# EAGLE schematic MiniMoto -- BREAKOUT (EAGLE 6.4)
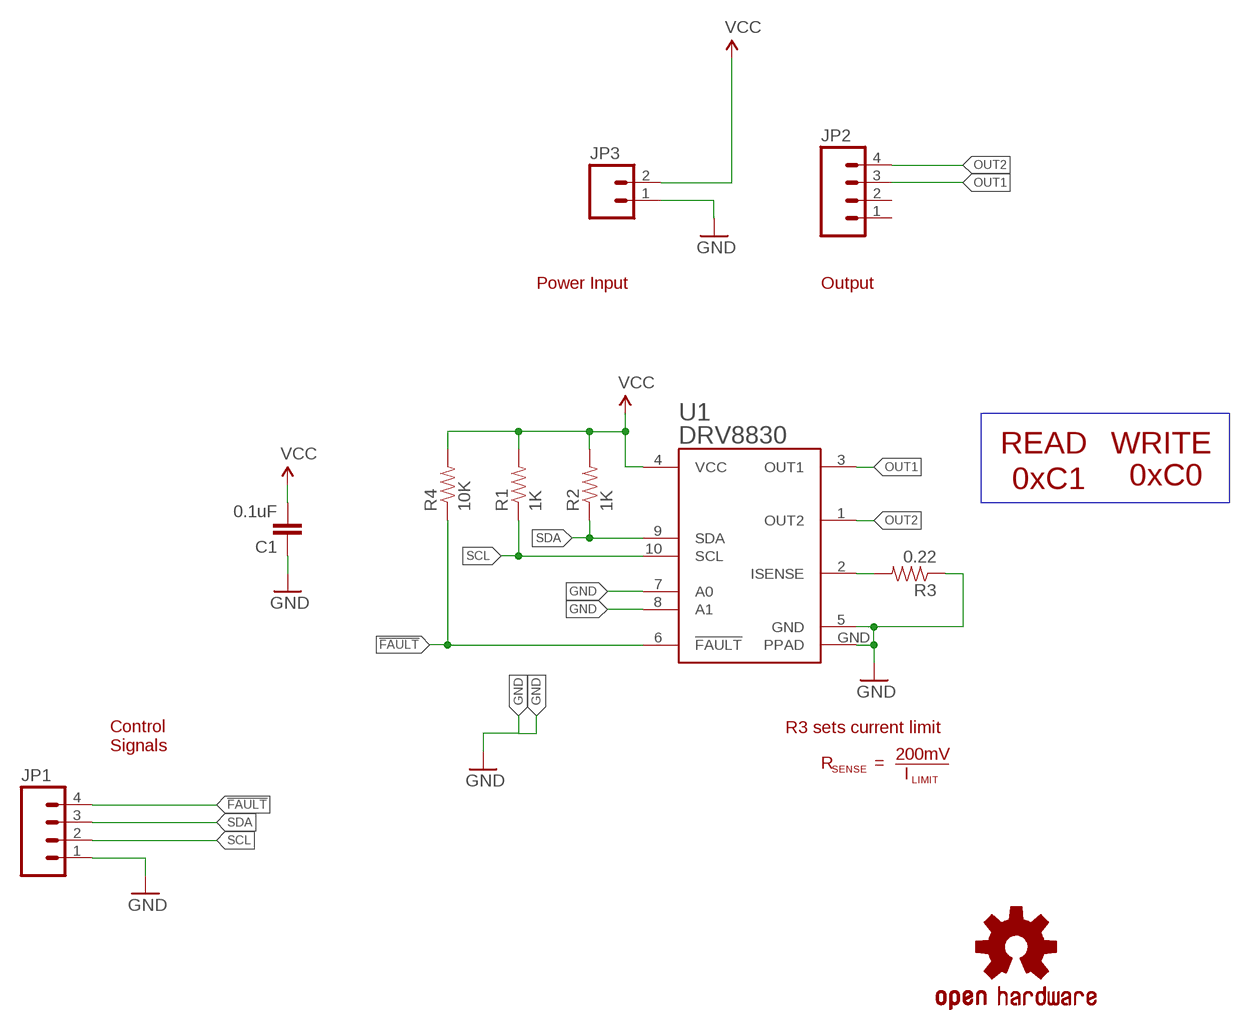
[diagram p0: schematic, sheet 1]

## Parts
C1  0.1uF  0.1UF-25V(+80/-20%)(0603)  [0603-CAP]
JP1  M04PTH  [1X04]
JP2  M04PTH  [1X04]
JP3  M02LOCK  [1X02_LOCK]
LOGO3  OSHW-LOGOS  [OSHW-LOGO-S]
R1  1K  1KOHM1/10W1%(0603)  [0603-RES]
R2  1K  1KOHM1/10W1%(0603)  [0603-RES]
R3  0.22  0.22OHM1/4W1%(0805)  [0805]
R4  10K  10KOHM1/10W1%(0603)0603  [0603-RES]
U1  DRV8830  [MSOP-10-GNDPAD]

## Nets
!FAULT: JP1.4 R4.1 U1.6(!FAULT)
GND: C1.1 JP1.1 JP3.1 R3.1 U1.5(GND) U1.7(A0) U1.8(A1) U1.GND(PPAD)
N$3: R3.2 U1.2(ISENSE)
OUT1: JP2.3 U1.3(OUT1)
OUT2: JP2.4 U1.1(OUT2)
SCL: JP1.2 R1.1 U1.10(SCL)
SDA: JP1.3 R2.1 U1.9(SDA)
VCC: C1.2 JP3.2 R1.2 R2.2 R4.2 U1.4(VCC)
Unconnected: JP2.1 JP2.2

## Buses
B$1

## Notes on the sheet
- Power Input | Output
- READ | WRITE
- 0xC1 | 0xC0
- R3 sets current limit
- Control
  Signals
- 200mV
- R | =
- SENSE
- I
- LIMIT

## Library data of the parts
C1 = SparkFun-Capacitors:0.1UF-25V(+80/-20%)(0603): Ceramic Standard decoupling cap CAP-00810; PROD_ID: CAP-00810
JP1 JP2 = SparkFun:M04: Header 4 Standard 4-pin 0.1" header. Use with straight break away headers (SKU : PRT-00116), right angle break away headers (PRT-00553), swiss pins (PRT-00743), machine pins (PRT-00117), and female headers (PRT-00115). Molex polarized connector foot print use with SKU : PRT-08231 with associated crimp pins and housings. 1MM SMD Version SKU: PRT-10208
JP3 = SparkFun:M02: Header 2 Standard 2-pin 0.1" header. Use with straight break away headers (SKU : PRT-00116), right angle break away headers (PRT-00553), swiss pins (PRT-00743), machine pins (PRT-00117), and female headers (PRT-00115). Molex polarized connector foot print use with SKU : PRT-08233 with associated crimp pins and housings.
LOGO3 = SparkFun-Aesthetics:OSHW-LOGO: Open Source Hardware Logo This logo indicates the piece of hardware it is found on incorporates a OSHW license and/or adheres to the definition of open source hardware found here: http://freedomdefined.org/OSHW
R1 R2 = SparkFun-Resistors:1KOHM1/10W1%(0603): RES-07856; PROD_ID: RES-07856
R3 = SparkFun-Resistors:0.22OHM1/4W1%(0805): RES-09883; PROD_ID: RES-09883
R4 = SparkFun-Resistors:10KOHM1/10W1%(0603): RES-00824; PROD_ID: RES-00824
U1 = SparkFun-PowerIC:DRV8830: DRV8830 I2C DC Motor Driver TSSOP-10 with exposed power pad 1A current limit, 2.75V to 6.8V